# Altium schematic sheet HB_Driver2.SchDoc
size A4
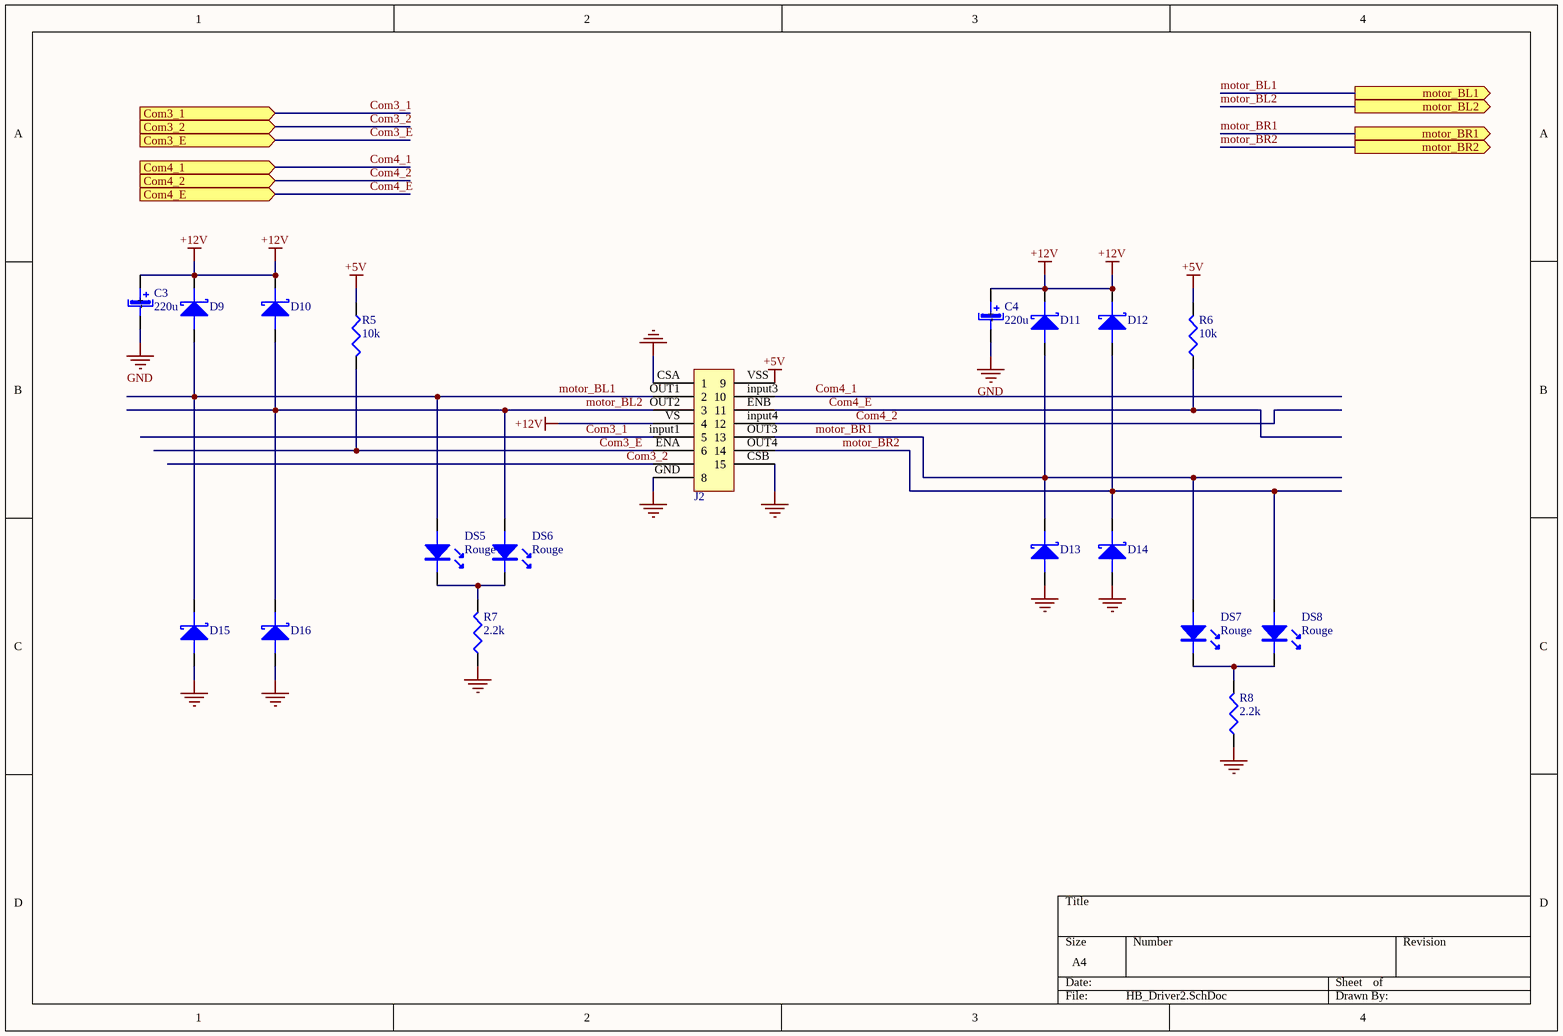
[diagram p0: HB_Driver2.SchDoc]

## Parts
C3  value 220u  [CAPAE0810X700N]  (hidden comment: Cap_220u)
C4  value 220u  [CAPAE0810X700N]  (hidden comment: Cap_220u)
D9  Diode Schottky  [SOD-123]  (value not drawn)
D10  Diode Schottky  [SOD-123]  (value not drawn)
D11  Diode Schottky  [SOD-123]  (value not drawn)
D12  Diode Schottky  [SOD-123]  (value not drawn)
D13  Diode Schottky  [SOD-123]  (value not drawn)
D14  Diode Schottky  [SOD-123]  (value not drawn)
D15  Diode Schottky  [SOD-123]  (value not drawn)
D16  Diode Schottky  [SOD-123]  (value not drawn)
DS5  Color: Rouge  [3.5X2.8X1.9]  (hidden comment: LED)
DS6  Color: Rouge  [3.5X2.8X1.9]  (hidden comment: LED)
DS7  Color: Rouge  [3.5X2.8X1.9]  (hidden comment: LED)
DS8  Color: Rouge  [3.5X2.8X1.9]  (hidden comment: LED)
J2  L298  [MultiWatt15]  (value not drawn)
R5  value 10k  [6-0805_L]  (hidden comment: Res_10k)
R6  value 10k  [6-0805_L]  (hidden comment: Res_10k)
R7  value 2.2k  [6-0805_L]  (hidden comment: Res_2.2k)
R8  value 2.2k  [6-0805_L]  (hidden comment: Res_2.2k)

## Ports
Com3_1 (in), Com3_2 (in), Com3_E (in), Com4_1 (in), Com4_2 (in), Com4_E (in), motor_BL1 (out), motor_BL2 (out), motor_BR1 (out), motor_BR2 (out)

## Nets
+5V: J2.VSS(9) R5.1 R6.2
+12V: C3.POS(+) C4.POS(+) D9.1(K) D10.1(K) D11.1(K) D12.1(K) J2.VS(4)
GND: C3.NEG(-) C4.NEG(-) D13.2(A) D14.2(A) D15.2(A) D16.2(A) J2.CSA(1) J2.CSB(15) J2.GND(8) R7.1 R8.1
Com3_1: J2.input1(5) ; port Com3_1
Com3_2: J2.input2 ; port Com3_2
Com3_E: J2.ENA(6) R5.2 ; port Com3_E
Com4_1: J2.input3(10) ; port Com4_1
Com4_2: J2.input4(12) ; port Com4_2
Com4_E: J2.ENB(11) R6.1 ; port Com4_E
motor_BL1: D9.2(A) D15.1(K) DS5.1(A) J2.OUT1(2) ; port motor_BL1
motor_BL2: D10.2(A) D16.1(K) DS6.1(A) J2.OUT2(3) ; port motor_BL2
motor_BR1: D11.2(A) D13.1(K) DS7.1(A) J2.OUT3(13) ; port motor_BR1
motor_BR2: D12.2(A) D14.1(K) DS8.1(A) J2.OUT4(14) ; port motor_BR2
NetDS5_2: DS5.2(K) DS6.2(K) R7.2
NetDS7_2: DS7.2(K) DS8.2(K) R8.2

## Library data of the parts
C3 C4 = Cap_220u: Condensateur polatisé; Type: Condensateur polarisé debout; Designer: ECAM 2004; Supplier: RS 537-0641
J2 = L298: Connecteur; Designer: ECAM 2004; Supplier: ECAM
R5 R6 = Res_10k: Résistance standard; Designer: ECAM 2005; Supplier: RS 740-8805; Type: Résistance standard
R7 R8 = Res_2.2k: Résistance standard; Designer: ECAM 2005; Supplier: RS 679-1207; Type: Résistance standard
D9-D16 = Diode Schottky: Designer: ECAM 2005; Supplier: RS 708-2197
DS5-DS8 = LED: Designer: ECAM 2004; Type: LED; Supplier: RS 176-6077